# Altium project slave-18-ltc6813-1.PrjPcb (part 2 of 3)

## Sheet feedback.SchDoc: foxBMS BMS-Slave 12-Cell
size A3; DocumentNumber: 6; SheetNumber: 6; SheetTotal: 15; AUTHOR: Fraunhofer IISB foxBMS Team; SheetDescription: Passive Balancing Feedback
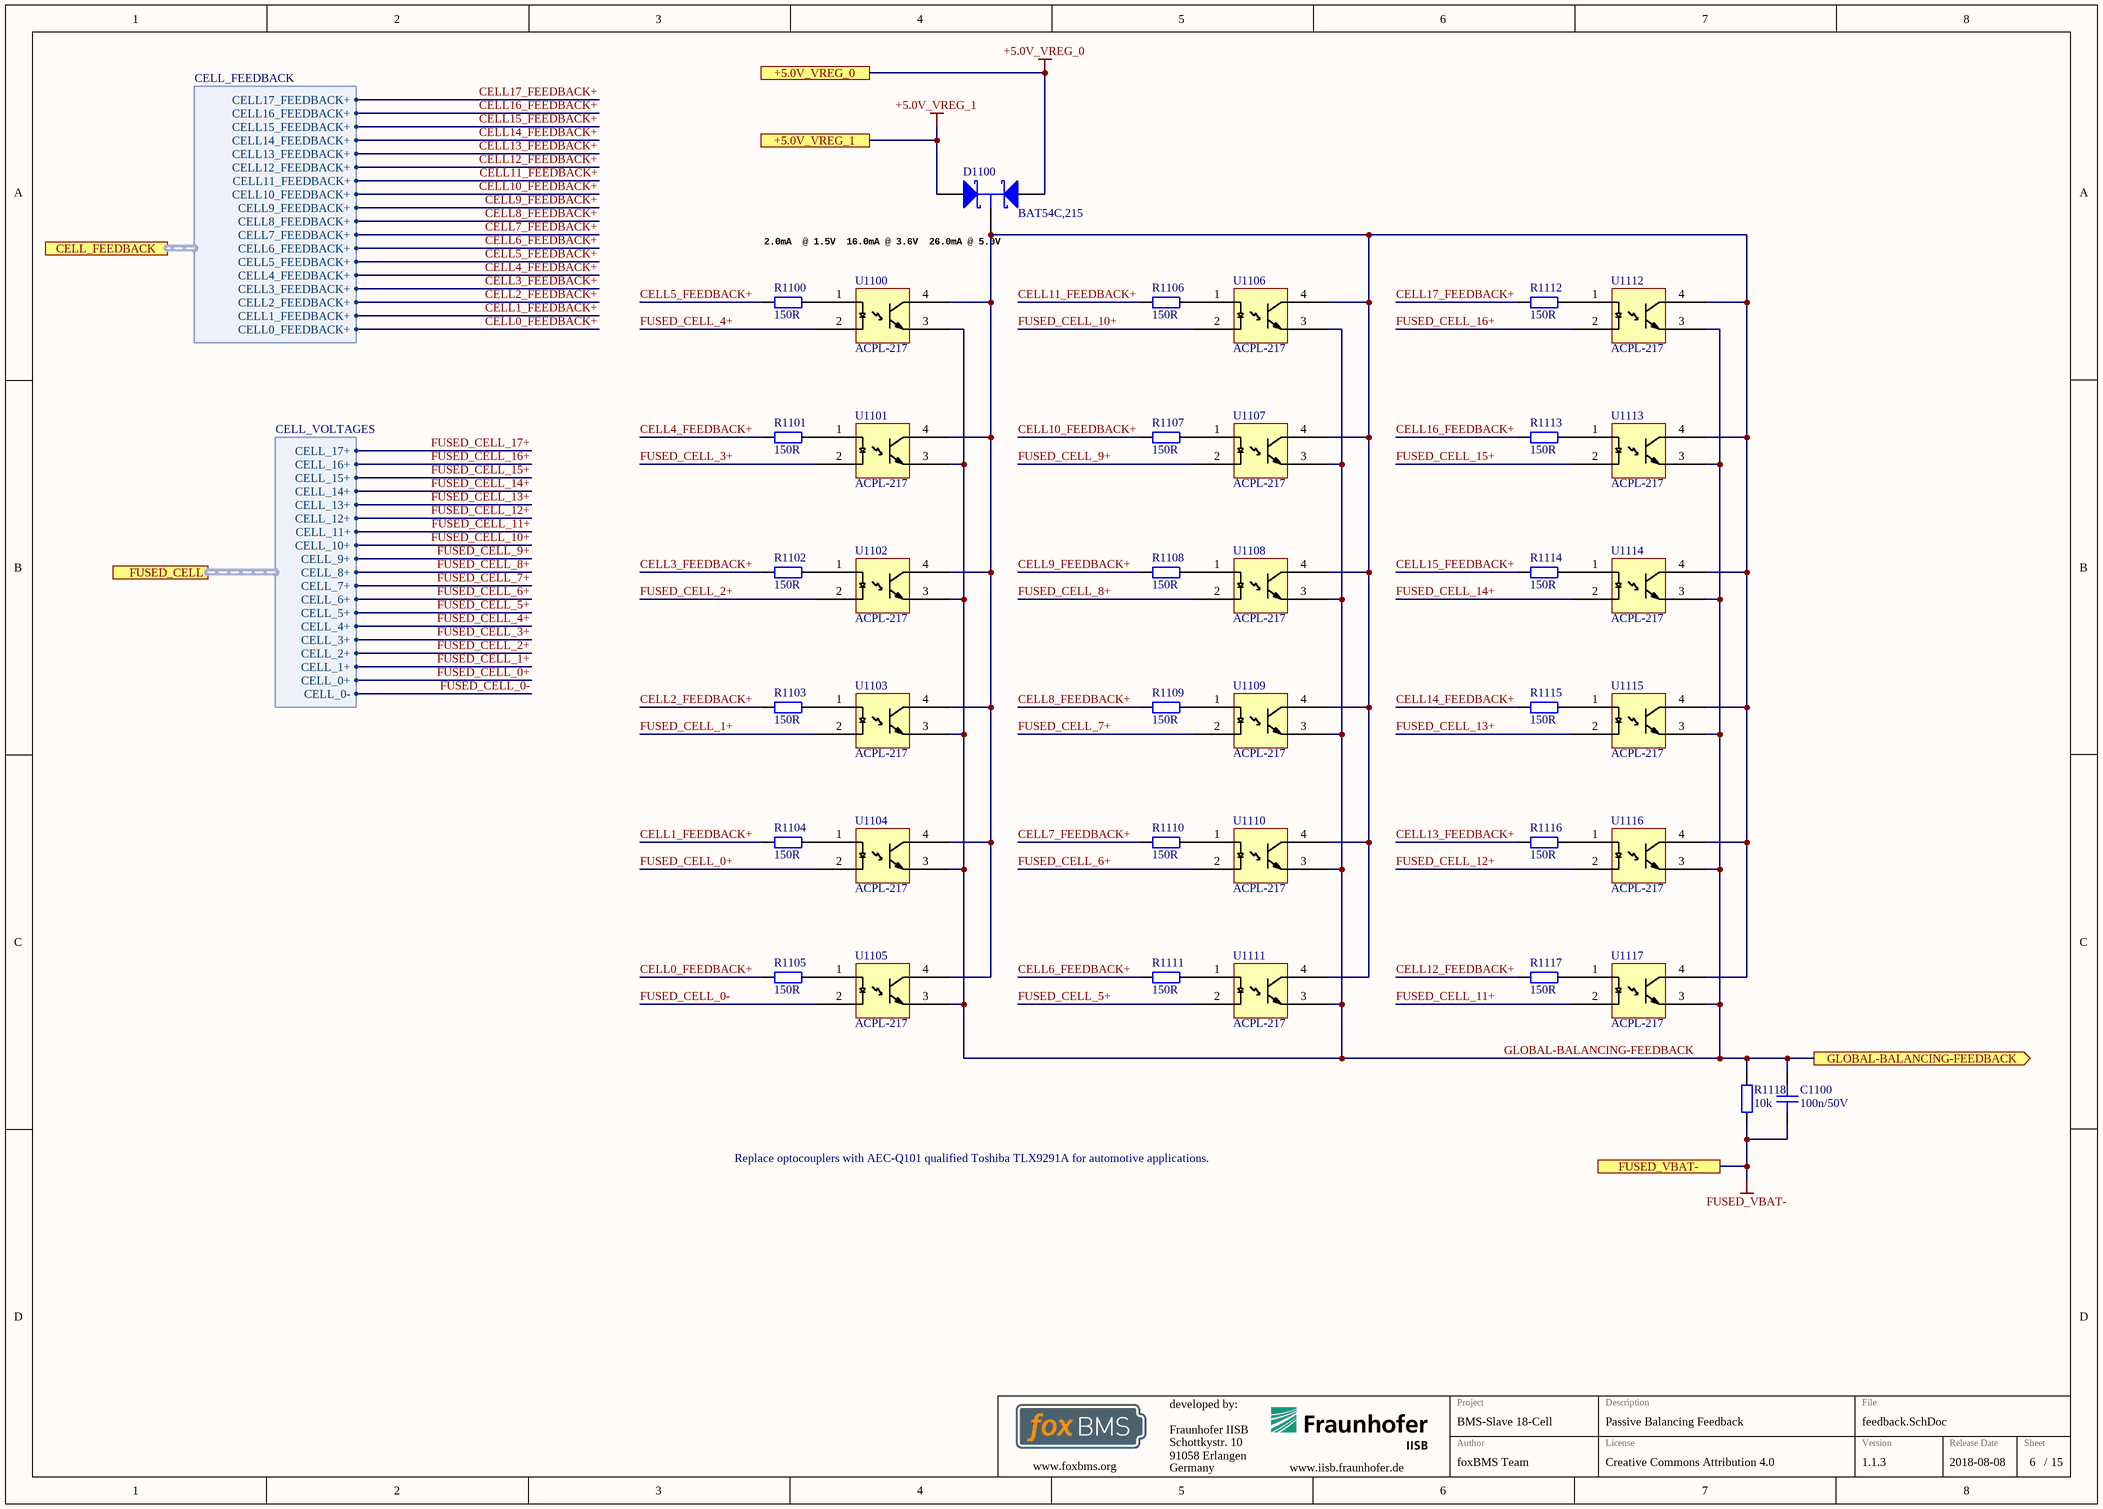
[diagram p5: feedback.SchDoc]

### Parts
C1100  100n/50V  [CAPC1608X08N]
D1100  BAT54C,215  [NXP-SOT23-3_V]
R1100  150R  [RESC1608X05N]
R1101  150R  [RESC1608X05N]
R1102  150R  [RESC1608X05N]
R1103  150R  [RESC1608X05N]
R1104  150R  [RESC1608X05N]
R1105  150R  [RESC1608X05N]
R1106  150R  [RESC1608X05N]
R1107  150R  [RESC1608X05N]
R1108  150R  [RESC1608X05N]
R1109  150R  [RESC1608X05N]
R1110  150R  [RESC1608X05N]
R1111  150R  [RESC1608X05N]
R1112  150R  [RESC1608X05N]
R1113  150R  [RESC1608X05N]
R1114  150R  [RESC1608X05N]
R1115  150R  [RESC1608X05N]
R1116  150R  [RESC1608X05N]
R1117  150R  [RESC1608X05N]
R1118  10k  [RESC1608X05N]
U1100  ACPL-217  [SOIC127P700X220-4N]
U1101  ACPL-217  [SOIC127P700X220-4N]
U1102  ACPL-217  [SOIC127P700X220-4N]
U1103  ACPL-217  [SOIC127P700X220-4N]
U1104  ACPL-217  [SOIC127P700X220-4N]
U1105  ACPL-217  [SOIC127P700X220-4N]
U1106  ACPL-217  [SOIC127P700X220-4N]
U1107  ACPL-217  [SOIC127P700X220-4N]
U1108  ACPL-217  [SOIC127P700X220-4N]
U1109  ACPL-217  [SOIC127P700X220-4N]
U1110  ACPL-217  [SOIC127P700X220-4N]
U1111  ACPL-217  [SOIC127P700X220-4N]
U1112  ACPL-217  [SOIC127P700X220-4N]
U1113  ACPL-217  [SOIC127P700X220-4N]
U1114  ACPL-217  [SOIC127P700X220-4N]
U1115  ACPL-217  [SOIC127P700X220-4N]
U1116  ACPL-217  [SOIC127P700X220-4N]
U1117  ACPL-217  [SOIC127P700X220-4N]

### Ports
+5.0V_VREG_0, +5.0V_VREG_1, CELL_FEEDBACK (harness CELL_FEEDBACK), FUSED_CELL (harness CELL_VOLTAGES), FUSED_VBAT-, GLOBAL-BALANCING-FEEDBACK (out)

### Harnesses
CELL_VOLTAGES: CELL_0-, CELL_0+, CELL_1+, CELL_10+, CELL_11+, CELL_12+, CELL_13+, CELL_14+, CELL_15+, CELL_16+, CELL_17+, CELL_2+, CELL_3+, CELL_4+, CELL_5+, CELL_6+, CELL_7+, CELL_8+, CELL_9+
CELL_FEEDBACK: CELL11_FEEDBACK+, CELL10_FEEDBACK+, CELL9_FEEDBACK+, CELL8_FEEDBACK+, CELL7_FEEDBACK+, CELL6_FEEDBACK+, CELL5_FEEDBACK+, CELL4_FEEDBACK+, CELL3_FEEDBACK+, CELL2_FEEDBACK+, CELL1_FEEDBACK+, CELL0_FEEDBACK+, CELL12_FEEDBACK+, CELL13_FEEDBACK+, CELL14_FEEDBACK+, CELL15_FEEDBACK+, CELL16_FEEDBACK+, CELL17_FEEDBACK+

### Nets
+5.0V_VREG_0: D1100.2(A) ; port +5.0V_VREG_0  [project net +5.0V_VREG]
+5.0V_VREG_1: D1100.1(A) ; port +5.0V_VREG_1  [project net +5.0V_VREG]
FUSED_VBAT-: C1100.1 R1118.2 ; port FUSED_VBAT-
CELL0_FEEDBACK+: R1105.1 ; port CELL_FEEDBACK.CELL0_FEEDBACK+  [project net CELL_FEEDBACK.CELL0_FEEDBACK+]
CELL1_FEEDBACK+: R1104.1 ; port CELL_FEEDBACK.CELL1_FEEDBACK+  [project net CELL_FEEDBACK.CELL1_FEEDBACK+]
CELL2_FEEDBACK+: R1103.1 ; port CELL_FEEDBACK.CELL2_FEEDBACK+  [project net CELL_FEEDBACK.CELL2_FEEDBACK+]
CELL3_FEEDBACK+: R1102.1 ; port CELL_FEEDBACK.CELL3_FEEDBACK+  [project net CELL_FEEDBACK.CELL3_FEEDBACK+]
CELL4_FEEDBACK+: R1101.1 ; port CELL_FEEDBACK.CELL4_FEEDBACK+  [project net CELL_FEEDBACK.CELL4_FEEDBACK+]
CELL5_FEEDBACK+: R1100.1 ; port CELL_FEEDBACK.CELL5_FEEDBACK+  [project net CELL_FEEDBACK.CELL5_FEEDBACK+]
CELL6_FEEDBACK+: R1111.1 ; port CELL_FEEDBACK.CELL6_FEEDBACK+  [project net CELL_FEEDBACK.CELL6_FEEDBACK+]
CELL7_FEEDBACK+: R1110.1 ; port CELL_FEEDBACK.CELL7_FEEDBACK+  [project net CELL_FEEDBACK.CELL7_FEEDBACK+]
CELL8_FEEDBACK+: R1109.1 ; port CELL_FEEDBACK.CELL8_FEEDBACK+  [project net CELL_FEEDBACK.CELL8_FEEDBACK+]
CELL9_FEEDBACK+: R1108.1 ; port CELL_FEEDBACK.CELL9_FEEDBACK+  [project net CELL_FEEDBACK.CELL9_FEEDBACK+]
CELL10_FEEDBACK+: R1107.1 ; port CELL_FEEDBACK.CELL10_FEEDBACK+  [project net CELL_FEEDBACK.CELL10_FEEDBACK+]
CELL11_FEEDBACK+: R1106.1 ; port CELL_FEEDBACK.CELL11_FEEDBACK+  [project net CELL_FEEDBACK.CELL11_FEEDBACK+]
CELL12_FEEDBACK+: R1117.1 ; port CELL_FEEDBACK.CELL12_FEEDBACK+  [project net CELL_FEEDBACK.CELL12_FEEDBACK+]
CELL13_FEEDBACK+: R1116.1 ; port CELL_FEEDBACK.CELL13_FEEDBACK+  [project net CELL_FEEDBACK.CELL13_FEEDBACK+]
CELL14_FEEDBACK+: R1115.1 ; port CELL_FEEDBACK.CELL14_FEEDBACK+  [project net CELL_FEEDBACK.CELL14_FEEDBACK+]
CELL15_FEEDBACK+: R1114.1 ; port CELL_FEEDBACK.CELL15_FEEDBACK+  [project net CELL_FEEDBACK.CELL15_FEEDBACK+]
CELL16_FEEDBACK+: R1113.1 ; port CELL_FEEDBACK.CELL16_FEEDBACK+  [project net CELL_FEEDBACK.CELL16_FEEDBACK+]
CELL17_FEEDBACK+: R1112.1 ; port CELL_FEEDBACK.CELL17_FEEDBACK+  [project net CELL_FEEDBACK.CELL17_FEEDBACK+]
FUSED_CELL_0+: U1104.2 ; port FUSED_CELL.CELL_0+  [project net FUSED_CELL.CELL_0+]
FUSED_CELL_0-: U1105.2 ; port FUSED_CELL.CELL_0-  [project net FUSED_CELL.CELL_0-]
FUSED_CELL_1+: U1103.2 ; port FUSED_CELL.CELL_1+  [project net FUSED_CELL.CELL_1+]
FUSED_CELL_2+: U1102.2 ; port FUSED_CELL.CELL_2+  [project net FUSED_CELL.CELL_2+]
FUSED_CELL_3+: U1101.2 ; port FUSED_CELL.CELL_3+  [project net FUSED_CELL.CELL_3+]
FUSED_CELL_4+: U1100.2 ; port FUSED_CELL.CELL_4+  [project net FUSED_CELL.CELL_4+]
FUSED_CELL_5+: U1111.2 ; port FUSED_CELL.CELL_5+  [project net FUSED_CELL.CELL_5+]
FUSED_CELL_6+: U1110.2 ; port FUSED_CELL.CELL_6+  [project net FUSED_CELL.CELL_6+]
FUSED_CELL_7+: U1109.2 ; port FUSED_CELL.CELL_7+  [project net FUSED_CELL.CELL_7+]
FUSED_CELL_8+: U1108.2 ; port FUSED_CELL.CELL_8+  [project net FUSED_CELL.CELL_8+]
FUSED_CELL_9+: U1107.2 ; port FUSED_CELL.CELL_9+  [project net FUSED_CELL.CELL_9+]
FUSED_CELL_10+: U1106.2 ; port FUSED_CELL.CELL_10+  [project net FUSED_CELL.CELL_10+]
FUSED_CELL_11+: U1117.2 ; port FUSED_CELL.CELL_11+  [project net FUSED_CELL.CELL_11+]
FUSED_CELL_12+: U1116.2 ; port FUSED_CELL.CELL_12+  [project net FUSED_CELL.CELL_12+]
FUSED_CELL_13+: U1115.2 ; port FUSED_CELL.CELL_13+  [project net FUSED_CELL.CELL_13+]
FUSED_CELL_14+: U1114.2 ; port FUSED_CELL.CELL_14+  [project net FUSED_CELL.CELL_14+]
FUSED_CELL_15+: U1113.2 ; port FUSED_CELL.CELL_15+  [project net FUSED_CELL.CELL_15+]
FUSED_CELL_16+: U1112.2 ; port FUSED_CELL.CELL_16+  [project net FUSED_CELL.CELL_16+]
GLOBAL-BALANCING-FEEDBACK: C1100.2 R1118.1 U1100.3 U1101.3 U1102.3 U1103.3 U1104.3 U1105.3 U1106.3 U1107.3 U1108.3 U1109.3 U1110.3 U1111.3 U1112.3 U1113.3 U1114.3 U1115.3 U1116.3 U1117.3 ; port GLOBAL-BALANCING-FEEDBACK  [project net GLOBAL-BAL-FB]
NetD1100_3: D1100.3(K) U1100.4 U1101.4 U1102.4 U1103.4 U1104.4 U1105.4 U1106.4 U1107.4 U1108.4 U1109.4 U1110.4 U1111.4 U1112.4 U1113.4 U1114.4 U1115.4 U1116.4 U1117.4
NetR1100_2: R1100.2 U1100.1
NetR1101_2: R1101.2 U1101.1
NetR1102_2: R1102.2 U1102.1
NetR1103_2: R1103.2 U1103.1
NetR1104_2: R1104.2 U1104.1
NetR1105_2: R1105.2 U1105.1
NetR1106_2: R1106.2 U1106.1
NetR1107_2: R1107.2 U1107.1
NetR1108_2: R1108.2 U1108.1
NetR1109_2: R1109.2 U1109.1
NetR1110_2: R1110.2 U1110.1
NetR1111_2: R1111.2 U1111.1
NetR1112_2: R1112.2 U1112.1
NetR1113_2: R1113.2 U1113.1
NetR1114_2: R1114.2 U1114.1
NetR1115_2: R1115.2 U1115.1
NetR1116_2: R1116.2 U1116.1
NetR1117_2: R1117.2 U1117.1

### Notes on the sheet
- (near D1100) 2.0mA  @ 1.5V
  16.0mA @ 3.6V
  26.0mA @ 5.0V
- Replace optocouplers with AEC-Q101 qualified Toshiba TLX9291A for automotive applications.
- Fraunhofer IISB
- Schottkystr. 10
- developed by:
- 91058 Erlangen
- Germany
- Author
- Project
- License
- Description
- File
- Version
- Release Date
- Sheet
- www.foxbms.org
- www.iisb.fraunhofer.de
- foxBMS Team
- /

### Library data of the parts
C1100 = gen_C_ceramic_100n_50V_X7R_0603: as C903 on sheet ext_supply; Part Number: gen_C_ceramic_100n_50V_X7R_0603; Supplier 1: Farnell; Supplier Part Number 1: 2525267; Supplier 2: Digikey; Supplier Part Number 2: 490-6049-1-ND; Supplier 3: Farnell; Supplier Part Number 3: 2070398
D1100 = CMP-2000-04915-1: Schottky Barrier Diode, 30 V, 3-Pin SOT23, RoHS, Tape and Reel; Manufacturer: NXP Semiconductors; Forward Surge Current Ifsm Max: 600mA; Pin Configuration: 1A1,2A2,3comK; Package Version: Feb-16; Forward Voltage VF Max: 800mV; SMD Marking: L43/*W1; Diode Case Style: SOT-23; Reverse Recovery Time trr Typ: 5ns; Forward Current If(AV): 200mA; Reel Quantity: 3000; SVHC: NoSVHC(19-Dec-2012); No. of Pins: 3; Junction Temperature Tj Max: 125degC; Common Connection: Cathode; Repetitive Reverse Voltage Vrrm Max: 30V; Operating Temperature Max: 150degC; Operating Temperature Range: -65degCto+150degC; Termination Type: SMD; Package Description: 3-Pin Small Outline Transistor, Body 1.3 x 2.9 mm, Pitch 0.95 mm; Package / Case: SOT-23; Diode Type: Schottky; Manufacturer URL: http://www.nxp.com/; Tape Width: 8mm; Package Reference: SOT23-3; Datasheet URL: https://datasheet.ciiva.com/33723/1668625-33723936.pdf; Datasheet Version: Rev. 5 , 10/2012; Operating Temperature Min: -65degC; Current Ifsm: 600mA; Reverse Recovery Time trr Max: 5ns; Package URL: http://www.nxp.com/documents/outline_drawing/SOT23.pdf; Forward Voltage: 800mV
R1100-R1117 = gen_R_150R_0603: SMD Resistor 150R 0603; Tolerance: 1%; Power: 0.1W; Case EIA: 0603; Case Metric: 1608; Maximum Working Voltage: 75V; PnP Package: R_0603; Automotive Qualified: True; Part Number: gen_R_150R_0603; Operating Temperature: -55°C - +155°C; Resistance: 150R; Series: E24, E96; PnP Value: 150R; Supplier 1: Farnell; Supplier Part Number 1: 2303076
R1118 = gen_R_10k_0603: as R905 on sheet ext_supply; Part Number: gen_R_10k_0603; Operating Temperature: -55°C - +155°C; Resistance: 10k; Series: E24, E96; PnP Value: 10k; Supplier 1: Farnell; Supplier Part Number 1: 2073349
U1100-U1117 = ACPL-217-56BE: Optocoupler, Transistor Output, 1 Channel; Manufacturer: Broadcom Limited; Automotive Qualified: False; Part Number: ACPL-217-56BE; Part Name: ACPL-217; Operating Temperature: -55°C - +110°C; ComponentLink1Description: Datenblatt; ComponentLink1URL: http://www.farnell.com/datasheets/45634.pdf; Supplier 1: Farnell; Supplier Part Number 1: 1602623

## Sheet passive_balancing.SchDoc: foxBMS BMS-Slave 12-Cell
size A3; DocumentNumber: 5; SheetNumber: 5; SheetTotal: 15; AUTHOR: Fraunhofer IISB foxBMS Team; SheetDescription: Passive Cell Balancing
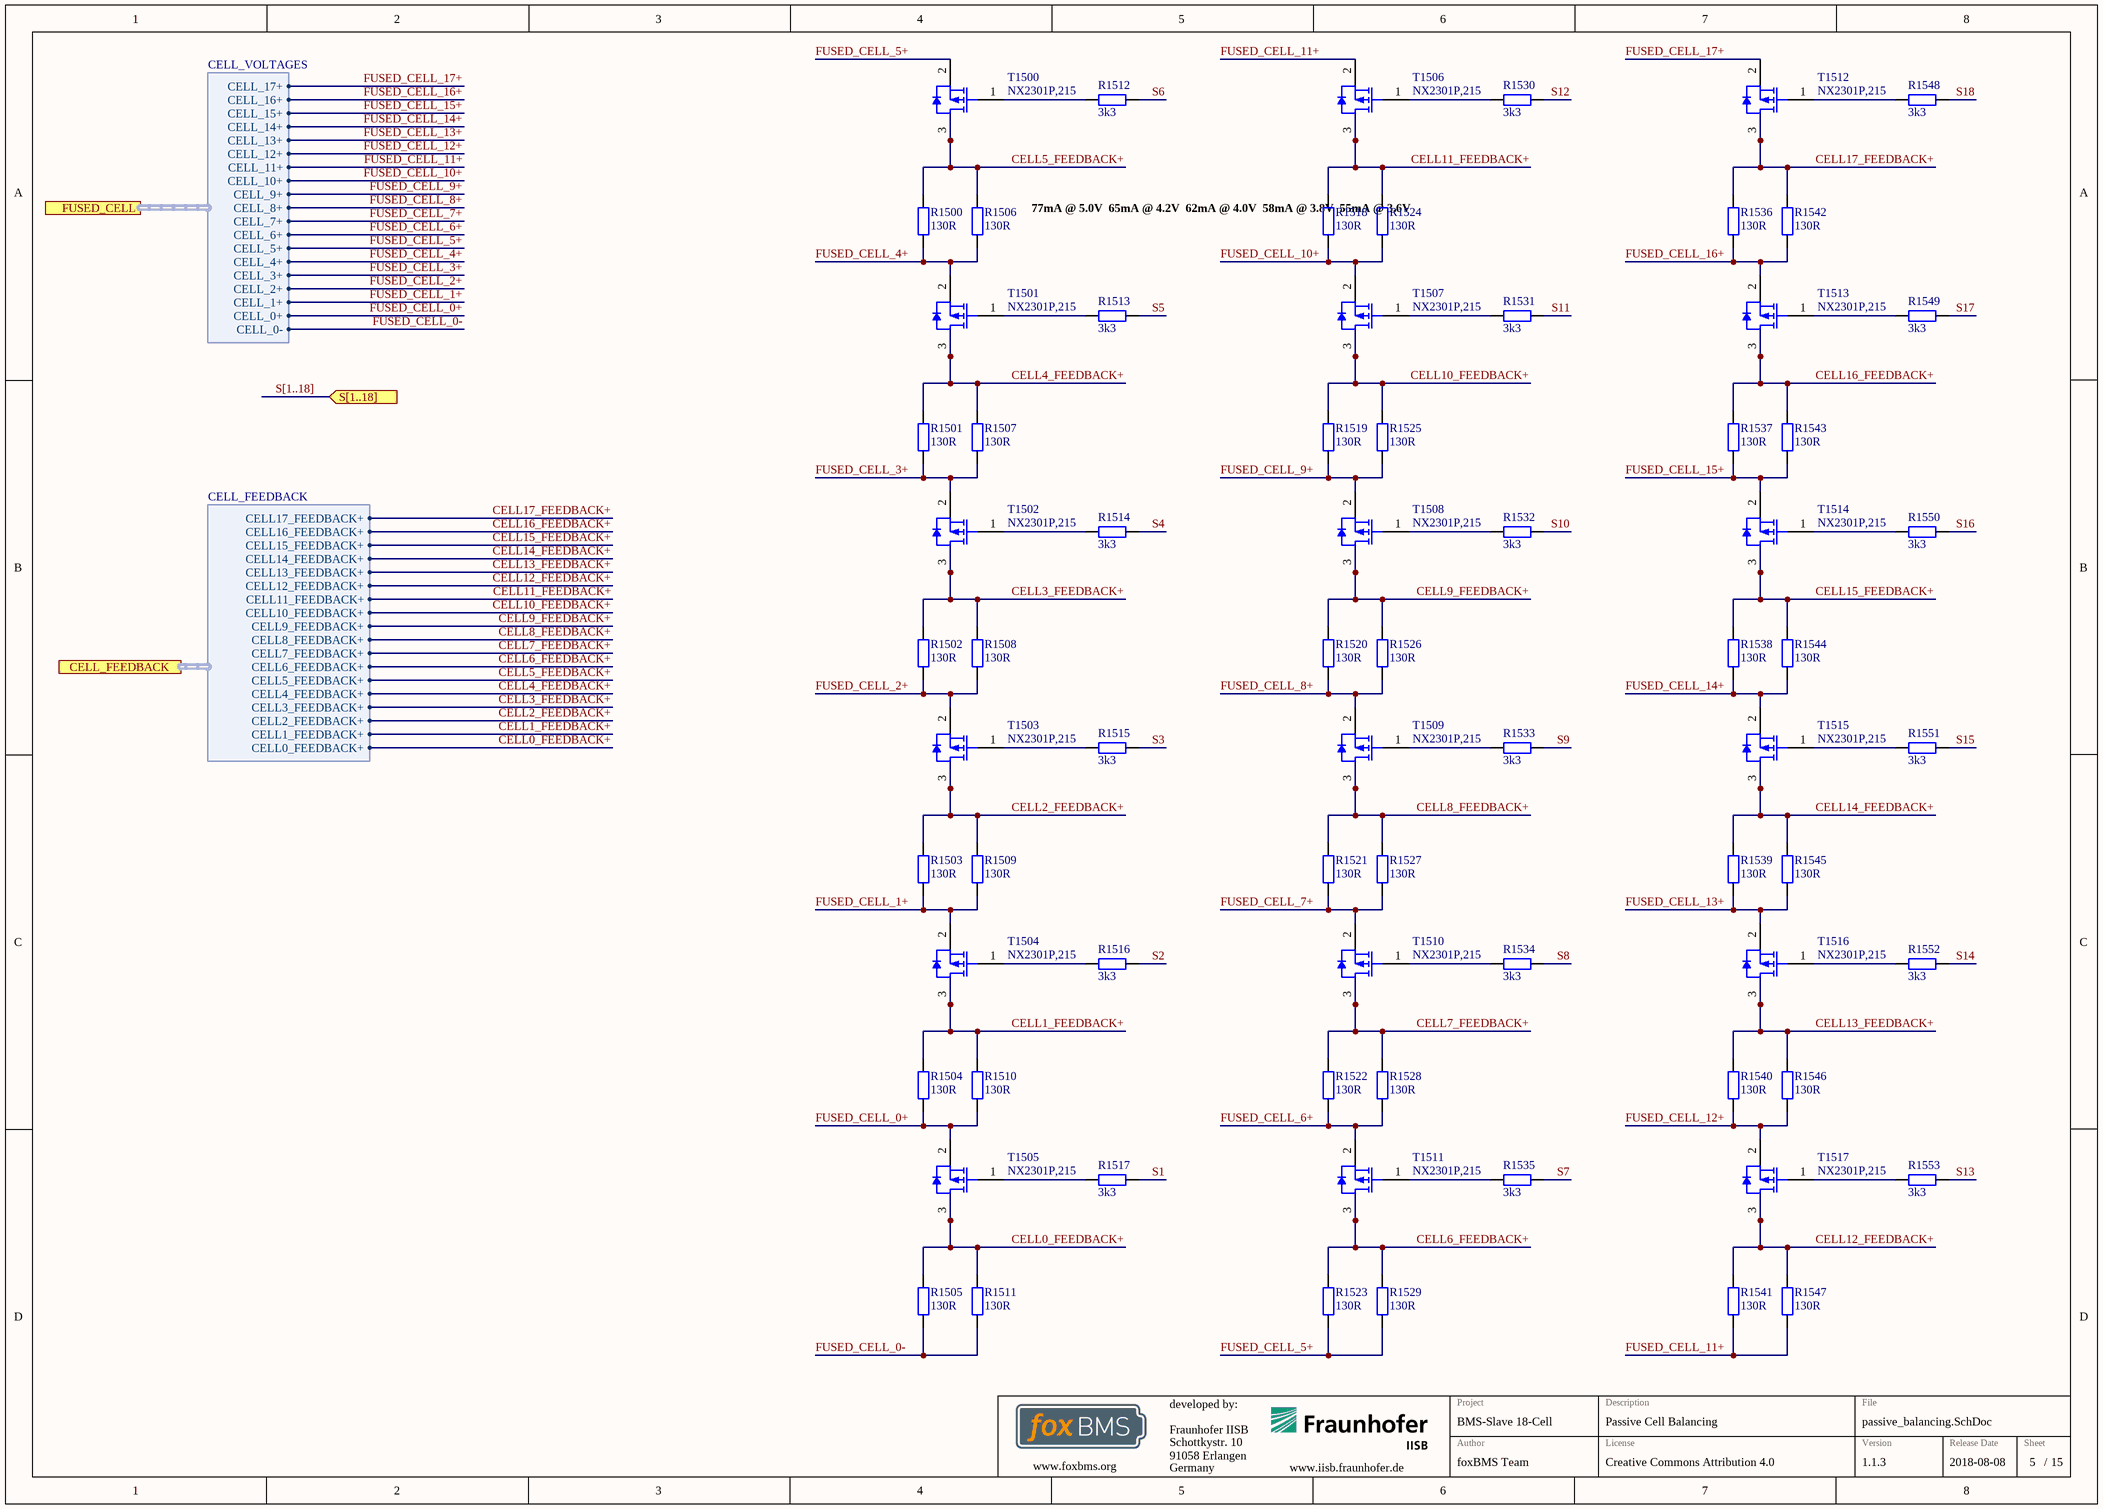
[diagram p6: passive_balancing.SchDoc]

### Parts
R1500  130R  [RESC5025X07N]
R1501  130R  [RESC5025X07N]
R1502  130R  [RESC5025X07N]
R1503  130R  [RESC5025X07N]
R1504  130R  [RESC5025X07N]
R1505  130R  [RESC5025X07N]
R1506  130R  [RESC5025X07N]
R1507  130R  [RESC5025X07N]
R1508  130R  [RESC5025X07N]
R1509  130R  [RESC5025X07N]
R1510  130R  [RESC5025X07N]
R1511  130R  [RESC5025X07N]
R1512  3k3  [RESC1608X05N]
R1513  3k3  [RESC1608X05N]
R1514  3k3  [RESC1608X05N]
R1515  3k3  [RESC1608X05N]
R1516  3k3  [RESC1608X05N]
R1517  3k3  [RESC1608X05N]
R1518  130R  [RESC5025X07N]
R1519  130R  [RESC5025X07N]
R1520  130R  [RESC5025X07N]
R1521  130R  [RESC5025X07N]
R1522  130R  [RESC5025X07N]
R1523  130R  [RESC5025X07N]
R1524  130R  [RESC5025X07N]
R1525  130R  [RESC5025X07N]
R1526  130R  [RESC5025X07N]
R1527  130R  [RESC5025X07N]
R1528  130R  [RESC5025X07N]
R1529  130R  [RESC5025X07N]
R1530  3k3  [RESC1608X05N]
R1531  3k3  [RESC1608X05N]
R1532  3k3  [RESC1608X05N]
R1533  3k3  [RESC1608X05N]
R1534  3k3  [RESC1608X05N]
R1535  3k3  [RESC1608X05N]
R1536  130R  [RESC5025X07N]
R1537  130R  [RESC5025X07N]
R1538  130R  [RESC5025X07N]
R1539  130R  [RESC5025X07N]
R1540  130R  [RESC5025X07N]
R1541  130R  [RESC5025X07N]
R1542  130R  [RESC5025X07N]
R1543  130R  [RESC5025X07N]
R1544  130R  [RESC5025X07N]
R1545  130R  [RESC5025X07N]
R1546  130R  [RESC5025X07N]
R1547  130R  [RESC5025X07N]
R1548  3k3  [RESC1608X05N]
R1549  3k3  [RESC1608X05N]
R1550  3k3  [RESC1608X05N]
R1551  3k3  [RESC1608X05N]
R1552  3k3  [RESC1608X05N]
R1553  3k3  [RESC1608X05N]
T1500  NX2301P,215  [NXP-SOT23_N]
T1501  NX2301P,215  [NXP-SOT23_N]
T1502  NX2301P,215  [NXP-SOT23_N]
T1503  NX2301P,215  [NXP-SOT23_N]
T1504  NX2301P,215  [NXP-SOT23_N]
T1505  NX2301P,215  [NXP-SOT23_N]
T1506  NX2301P,215  [NXP-SOT23_N]
T1507  NX2301P,215  [NXP-SOT23_N]
T1508  NX2301P,215  [NXP-SOT23_N]
T1509  NX2301P,215  [NXP-SOT23_N]
T1510  NX2301P,215  [NXP-SOT23_N]
T1511  NX2301P,215  [NXP-SOT23_N]
T1512  NX2301P,215  [NXP-SOT23_N]
T1513  NX2301P,215  [NXP-SOT23_N]
T1514  NX2301P,215  [NXP-SOT23_N]
T1515  NX2301P,215  [NXP-SOT23_N]
T1516  NX2301P,215  [NXP-SOT23_N]
T1517  NX2301P,215  [NXP-SOT23_N]

### Ports
CELL_FEEDBACK (harness CELL_FEEDBACK), FUSED_CELL (harness CELL_VOLTAGES), S[1..18] (in)

### Harnesses
CELL_FEEDBACK: CELL11_FEEDBACK+, CELL10_FEEDBACK+, CELL9_FEEDBACK+, CELL8_FEEDBACK+, CELL7_FEEDBACK+, CELL6_FEEDBACK+, CELL5_FEEDBACK+, CELL4_FEEDBACK+, CELL3_FEEDBACK+, CELL2_FEEDBACK+, CELL1_FEEDBACK+, CELL0_FEEDBACK+, CELL12_FEEDBACK+, CELL13_FEEDBACK+, CELL14_FEEDBACK+, CELL15_FEEDBACK+, CELL16_FEEDBACK+, CELL17_FEEDBACK+
CELL_VOLTAGES: CELL_0-, CELL_0+, CELL_1+, CELL_10+, CELL_11+, CELL_12+, CELL_13+, CELL_14+, CELL_15+, CELL_16+, CELL_17+, CELL_2+, CELL_3+, CELL_4+, CELL_5+, CELL_6+, CELL_7+, CELL_8+, CELL_9+

### Nets
CELL0_FEEDBACK+: R1505.2 R1511.2 T1505.3(D) ; port CELL_FEEDBACK.CELL0_FEEDBACK+  [project net CELL_FEEDBACK.CELL0_FEEDBACK+]
CELL1_FEEDBACK+: R1504.2 R1510.2 T1504.3(D) ; port CELL_FEEDBACK.CELL1_FEEDBACK+  [project net CELL_FEEDBACK.CELL1_FEEDBACK+]
CELL2_FEEDBACK+: R1503.2 R1509.2 T1503.3(D) ; port CELL_FEEDBACK.CELL2_FEEDBACK+  [project net CELL_FEEDBACK.CELL2_FEEDBACK+]
CELL3_FEEDBACK+: R1502.2 R1508.2 T1502.3(D) ; port CELL_FEEDBACK.CELL3_FEEDBACK+  [project net CELL_FEEDBACK.CELL3_FEEDBACK+]
CELL4_FEEDBACK+: R1501.2 R1507.2 T1501.3(D) ; port CELL_FEEDBACK.CELL4_FEEDBACK+  [project net CELL_FEEDBACK.CELL4_FEEDBACK+]
CELL5_FEEDBACK+: R1500.2 R1506.2 T1500.3(D) ; port CELL_FEEDBACK.CELL5_FEEDBACK+  [project net CELL_FEEDBACK.CELL5_FEEDBACK+]
CELL6_FEEDBACK+: R1523.2 R1529.2 T1511.3(D) ; port CELL_FEEDBACK.CELL6_FEEDBACK+  [project net CELL_FEEDBACK.CELL6_FEEDBACK+]
CELL7_FEEDBACK+: R1522.2 R1528.2 T1510.3(D) ; port CELL_FEEDBACK.CELL7_FEEDBACK+  [project net CELL_FEEDBACK.CELL7_FEEDBACK+]
CELL8_FEEDBACK+: R1521.2 R1527.2 T1509.3(D) ; port CELL_FEEDBACK.CELL8_FEEDBACK+  [project net CELL_FEEDBACK.CELL8_FEEDBACK+]
CELL9_FEEDBACK+: R1520.2 R1526.2 T1508.3(D) ; port CELL_FEEDBACK.CELL9_FEEDBACK+  [project net CELL_FEEDBACK.CELL9_FEEDBACK+]
CELL10_FEEDBACK+: R1519.2 R1525.2 T1507.3(D) ; port CELL_FEEDBACK.CELL10_FEEDBACK+  [project net CELL_FEEDBACK.CELL10_FEEDBACK+]
CELL11_FEEDBACK+: R1518.2 R1524.2 T1506.3(D) ; port CELL_FEEDBACK.CELL11_FEEDBACK+  [project net CELL_FEEDBACK.CELL11_FEEDBACK+]
CELL12_FEEDBACK+: R1541.2 R1547.2 T1517.3(D) ; port CELL_FEEDBACK.CELL12_FEEDBACK+  [project net CELL_FEEDBACK.CELL12_FEEDBACK+]
CELL13_FEEDBACK+: R1540.2 R1546.2 T1516.3(D) ; port CELL_FEEDBACK.CELL13_FEEDBACK+  [project net CELL_FEEDBACK.CELL13_FEEDBACK+]
CELL14_FEEDBACK+: R1539.2 R1545.2 T1515.3(D) ; port CELL_FEEDBACK.CELL14_FEEDBACK+  [project net CELL_FEEDBACK.CELL14_FEEDBACK+]
CELL15_FEEDBACK+: R1538.2 R1544.2 T1514.3(D) ; port CELL_FEEDBACK.CELL15_FEEDBACK+  [project net CELL_FEEDBACK.CELL15_FEEDBACK+]
CELL16_FEEDBACK+: R1537.2 R1543.2 T1513.3(D) ; port CELL_FEEDBACK.CELL16_FEEDBACK+  [project net CELL_FEEDBACK.CELL16_FEEDBACK+]
CELL17_FEEDBACK+: R1536.2 R1542.2 T1512.3(D) ; port CELL_FEEDBACK.CELL17_FEEDBACK+  [project net CELL_FEEDBACK.CELL17_FEEDBACK+]
FUSED_CELL_0+: R1504.1 R1510.1 T1505.2(S) ; port FUSED_CELL.CELL_0+  [project net FUSED_CELL.CELL_0+]
FUSED_CELL_0-: R1505.1 R1511.1 ; port FUSED_CELL.CELL_0-  [project net FUSED_CELL.CELL_0-]
FUSED_CELL_1+: R1503.1 R1509.1 T1504.2(S) ; port FUSED_CELL.CELL_1+  [project net FUSED_CELL.CELL_1+]
FUSED_CELL_2+: R1502.1 R1508.1 T1503.2(S) ; port FUSED_CELL.CELL_2+  [project net FUSED_CELL.CELL_2+]
FUSED_CELL_3+: R1501.1 R1507.1 T1502.2(S) ; port FUSED_CELL.CELL_3+  [project net FUSED_CELL.CELL_3+]
FUSED_CELL_4+: R1500.1 R1506.1 T1501.2(S) ; port FUSED_CELL.CELL_4+  [project net FUSED_CELL.CELL_4+]
FUSED_CELL_5+: R1523.1 R1529.1 T1500.2(S) ; port FUSED_CELL.CELL_5+  [project net FUSED_CELL.CELL_5+]
FUSED_CELL_6+: R1522.1 R1528.1 T1511.2(S) ; port FUSED_CELL.CELL_6+  [project net FUSED_CELL.CELL_6+]
FUSED_CELL_7+: R1521.1 R1527.1 T1510.2(S) ; port FUSED_CELL.CELL_7+  [project net FUSED_CELL.CELL_7+]
FUSED_CELL_8+: R1520.1 R1526.1 T1509.2(S) ; port FUSED_CELL.CELL_8+  [project net FUSED_CELL.CELL_8+]
FUSED_CELL_9+: R1519.1 R1525.1 T1508.2(S) ; port FUSED_CELL.CELL_9+  [project net FUSED_CELL.CELL_9+]
FUSED_CELL_10+: R1518.1 R1524.1 T1507.2(S) ; port FUSED_CELL.CELL_10+  [project net FUSED_CELL.CELL_10+]
FUSED_CELL_11+: R1541.1 R1547.1 T1506.2(S) ; port FUSED_CELL.CELL_11+  [project net FUSED_CELL.CELL_11+]
FUSED_CELL_12+: R1540.1 R1546.1 T1517.2(S) ; port FUSED_CELL.CELL_12+  [project net FUSED_CELL.CELL_12+]
FUSED_CELL_13+: R1539.1 R1545.1 T1516.2(S) ; port FUSED_CELL.CELL_13+  [project net FUSED_CELL.CELL_13+]
FUSED_CELL_14+: R1538.1 R1544.1 T1515.2(S) ; port FUSED_CELL.CELL_14+  [project net FUSED_CELL.CELL_14+]
FUSED_CELL_15+: R1537.1 R1543.1 T1514.2(S) ; port FUSED_CELL.CELL_15+  [project net FUSED_CELL.CELL_15+]
FUSED_CELL_16+: R1536.1 R1542.1 T1513.2(S) ; port FUSED_CELL.CELL_16+  [project net FUSED_CELL.CELL_16+]
FUSED_CELL_17+: T1512.2(S) ; port FUSED_CELL.CELL_17+  [project net FUSED_CELL.CELL_17+]
S1: R1517.2  [project net PRIMARY-S1]
S2: R1516.2  [project net PRIMARY-S2]
S3: R1515.2  [project net PRIMARY-S3]
S4: R1514.2  [project net PRIMARY-S4]
S5: R1513.2  [project net PRIMARY-S5]
S6: R1512.2  [project net PRIMARY-S6]
S7: R1535.2  [project net PRIMARY-S7]
S8: R1534.2  [project net PRIMARY-S8]
S9: R1533.2  [project net PRIMARY-S9]
S10: R1532.2  [project net PRIMARY-S10]
S11: R1531.2  [project net PRIMARY-S11]
S12: R1530.2  [project net PRIMARY-S12]
S13: R1553.2  [project net PRIMARY-S13]
S14: R1552.2  [project net PRIMARY-S14]
S15: R1551.2  [project net PRIMARY-S15]
S16: R1550.2  [project net PRIMARY-S16]
S17: R1549.2  [project net PRIMARY-S17]
S18: R1548.2  [project net PRIMARY-S18]
NetR1512_1: R1512.1 T1500.1(G)
NetR1513_1: R1513.1 T1501.1(G)
NetR1514_1: R1514.1 T1502.1(G)
NetR1515_1: R1515.1 T1503.1(G)
NetR1516_1: R1516.1 T1504.1(G)
NetR1517_1: R1517.1 T1505.1(G)
NetR1530_1: R1530.1 T1506.1(G)
NetR1531_1: R1531.1 T1507.1(G)
NetR1532_1: R1532.1 T1508.1(G)
NetR1533_1: R1533.1 T1509.1(G)
NetR1534_1: R1534.1 T1510.1(G)
NetR1535_1: R1535.1 T1511.1(G)
NetR1548_1: R1548.1 T1512.1(G)
NetR1549_1: R1549.1 T1513.1(G)
NetR1550_1: R1550.1 T1514.1(G)
NetR1551_1: R1551.1 T1515.1(G)
NetR1552_1: R1552.1 T1516.1(G)
NetR1553_1: R1553.1 T1517.1(G)

### Buses and harness runs
bus S[1..18] = port S[1..18]

### Notes on the sheet
- 77mA @ 5.0V
  65mA @ 4.2V
  62mA @ 4.0V
  58mA @ 3.8V
  55mA @ 3.6V
- Fraunhofer IISB
- Schottkystr. 10
- developed by:
- 91058 Erlangen
- Germany
- Author
- Project
- License
- Description
- File
- Version
- Release Date
- Sheet
- www.foxbms.org
- www.iisb.fraunhofer.de
- foxBMS Team
- /

### Library data of the parts
R1500-R1511 R1518-R1529 R1536-R1547 = gen_R_130R_2010: SMD Resistor 130R 2010; Tolerance: 5%; Power: 0.75W; Case EIA: 2010; Case Metric: 5025; Maximum Working Voltage: 400V; PnP Package: R_2010; Automotive Qualified: True; Part Number: gen_R_130R_2010; Operating Temperature: -55°C - +155°C; Resistance: 130R; Series: E24, E96; PnP Value: 130R; Supplier 1: Farnell; Supplier Part Number 1: 1892735
R1512-R1517 R1530-R1535 R1548-R1553 = gen_R_3k3_0603: SMD Resistor 3k3 0603; Tolerance: 1%; Power: 0.1W; Case EIA: 0603; Case Metric: 1608; Maximum Working Voltage: 75V; PnP Package: R_0603; Automotive Qualified: True; Part Number: gen_R_3k3_0603; Operating Temperature: -55°C - +155°C; Resistance: 3k3; Series: E24; PnP Value: 3k3; Supplier 1: Farnell; Supplier Part Number 1: 2303173
T1500-T1517 = CMP-1259-00090-1: P-Channel Trench MOSFET, -20 V, -2 A, -55 to 150 degC, 3-Pin SOT23, Tape and Reel; Manufacturer: NXP Semiconductors; VGSth [typ] (V): -0.75; Channel Type: P; Packing: Tape & Reel; Automotive Qualified: Y; IDM [max] (A): -6; PackageReference: SOT23; PartNumber: NX2301P,215; PackageVersion: 06-03-16, 03/2006; ComponentLink1URL: http://www.nxp.com/; ID [max] (A): -2; Mounting Technology: Surface Mount; ComponentLink1Description: Manufacturer URL; VDS [max] (V): -20; Code_JEDEC: TO-236AB; DatasheetVersion: Rev. 1; ComponentLink3URL: http://www.nxp.com/documents/outline_drawing/sot023_po.pdf; ComponentLink2Description: Datasheet; PackageDescription: 3-Pin Small Outline Transistor Package, Body 2.9 x 1.3 mm, Pitch 0.95 mm; ComponentLink3Description: Package Specification; ComponentLink2URL: http://www.nxp.com/documents/data_sheet/NX2301P.pdf

## Sheet LTC.SchDoc: foxBMS BMS-Slave 12-Cell
size A3; DocumentNumber: 2; SheetNumber: 2; SheetTotal: 15; AUTHOR: Fraunhofer IISB foxBMS Team; SheetDescription: Primary LTC6813
Used 2 times, as channels U_primary_LTC, U_secondary_LTC. Parts and nets are listed once, with the designators drawn on the sheet.
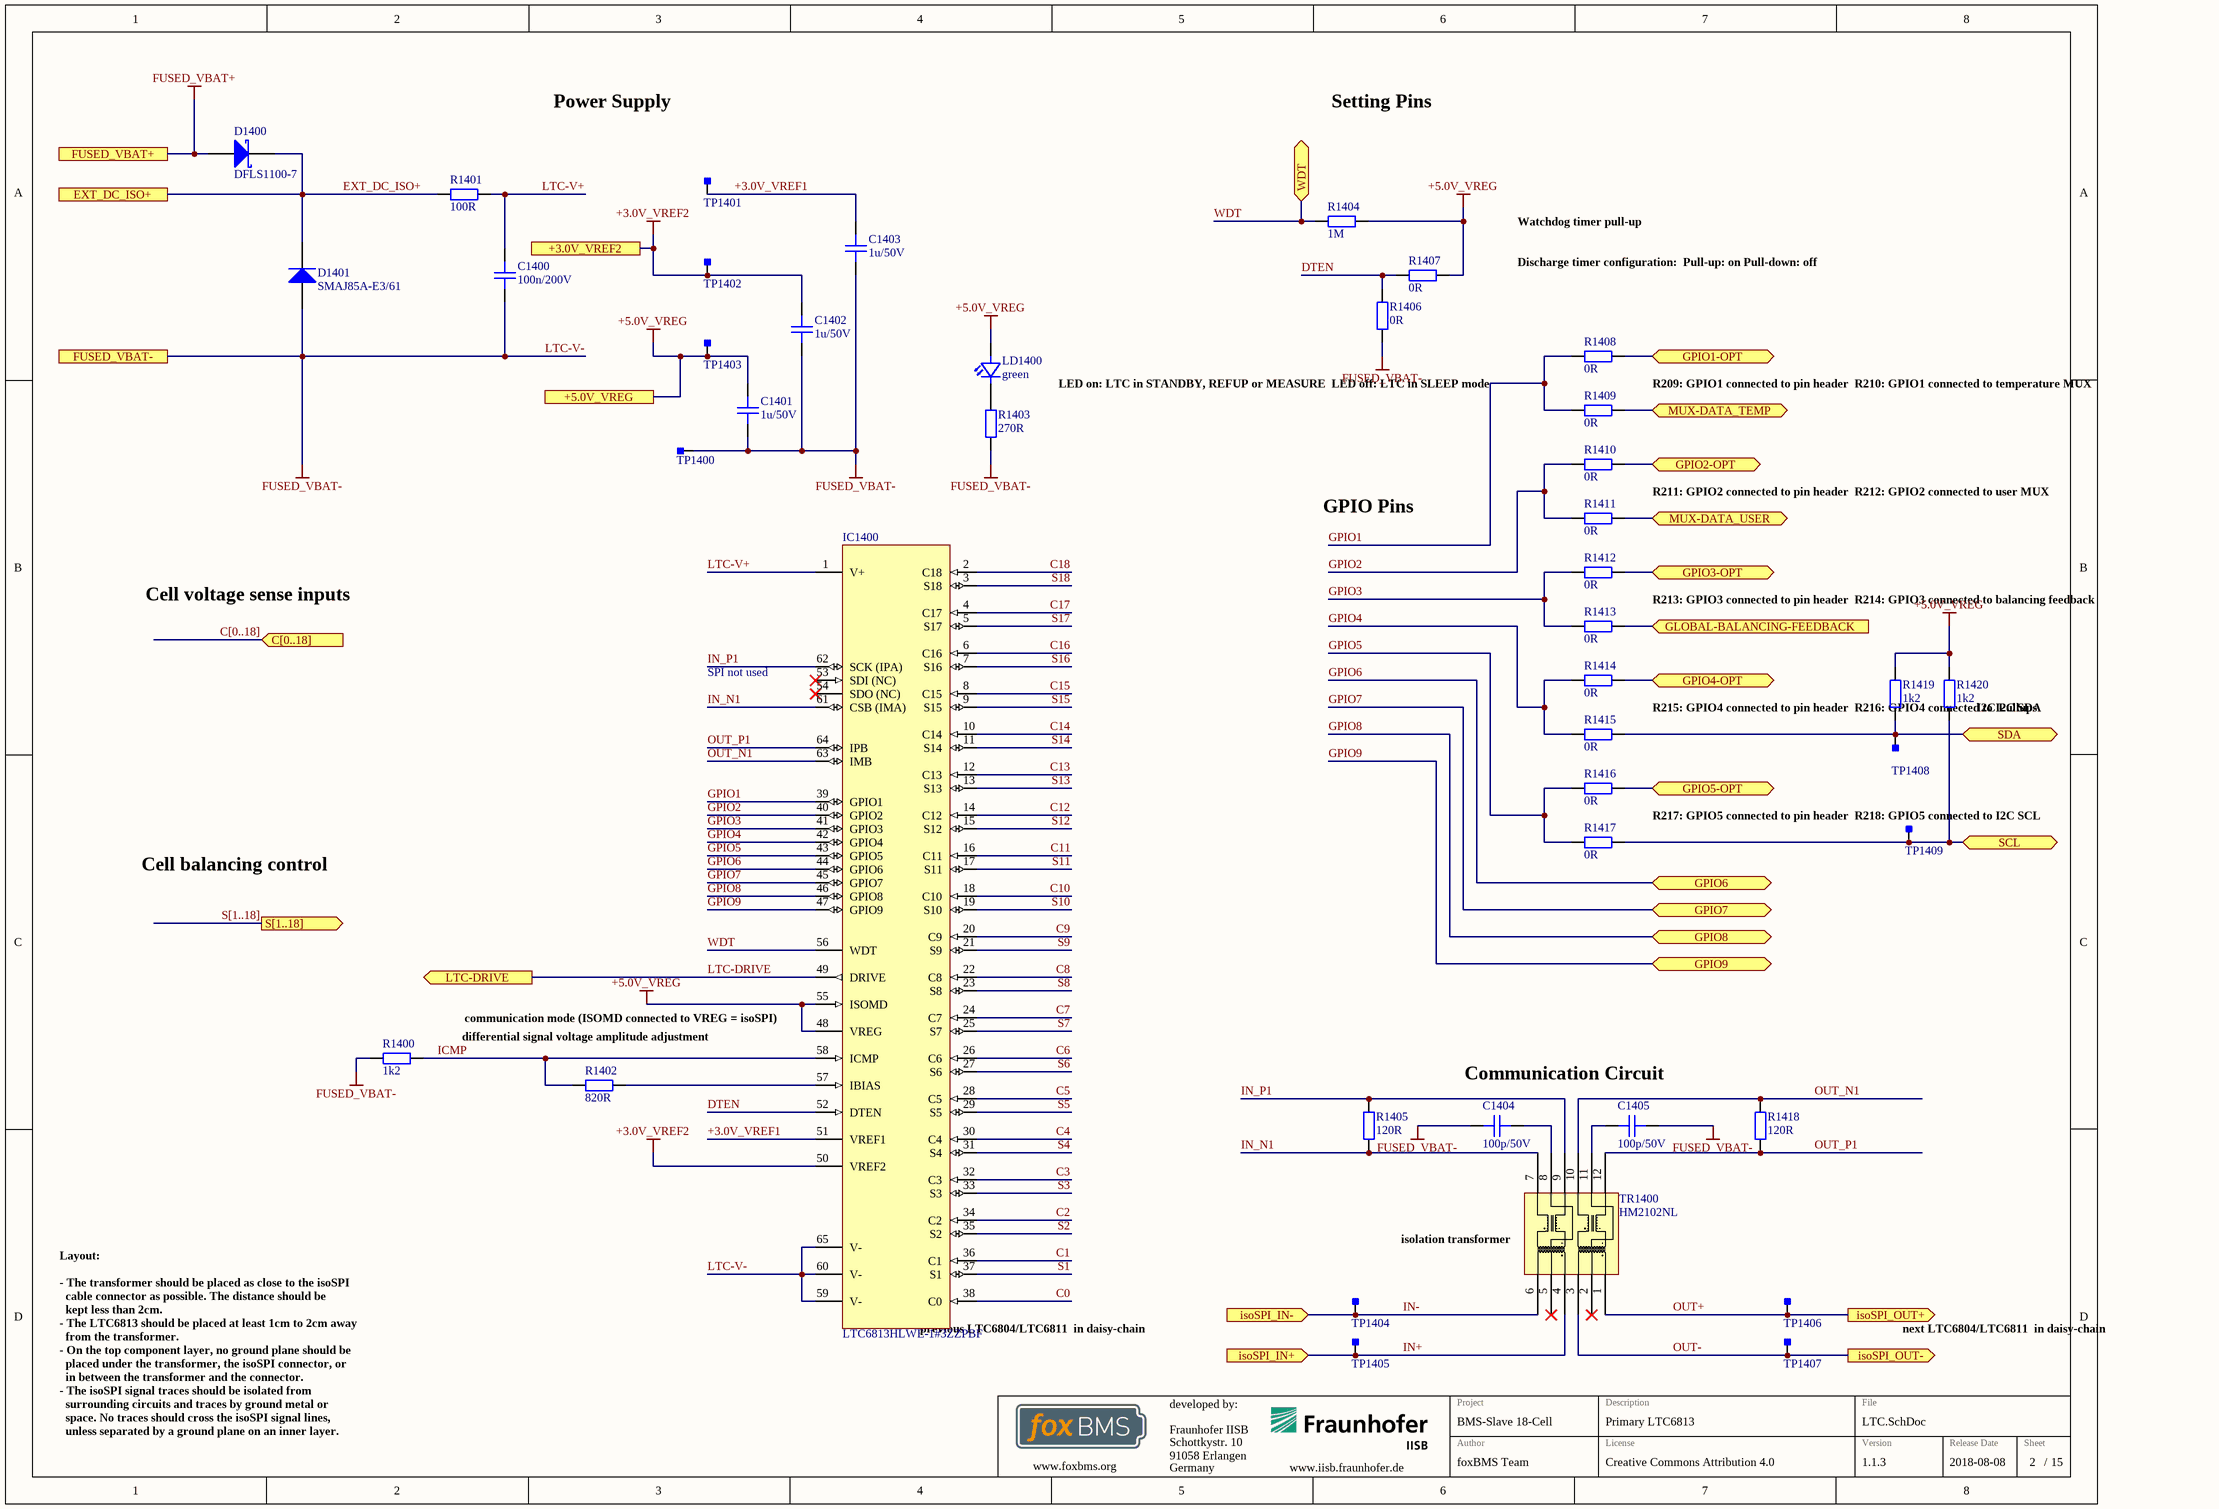
[diagram p7: LTC.SchDoc]

### Parts
C1400  100n/200V  [CAPC3216X18N]
C1401  1u/50V  [CAPC2012X14N]
C1402  1u/50V  [CAPC2012X14N]
C1403  1u/50V  [CAPC2012X14N]
C1404  100p/50V  [CAPC1608X08N]
C1405  100p/50V  [CAPC1608X08N]
D1400  DFLS1100-7  [DIOD-POWERDI123-2_V]
D1401  SMAJ85A-E3/61  [VISH-DO-214AC-2_L]
IC1400  LTC6813HLWE-1#3ZZPBF  [TSQFP50P1200X1200X160_HS-65N]
LD1400  green  [LEDC1608X07N]
R1400  1k2  [RESC1608X05N]
R1401  100R  [RESC2012X05N]
R1402  820R  [RESC1608X05N]
R1403  270R  [RESC1608X05N]
R1404  1M  [RESC1608X05N]
R1405  120R  [RESC1608X05N]
R1406  0R  [RESC1608X05N]
R1407  0R  [RESC1608X05N]
R1408  0R  [RESC1608X05N]
R1409  0R  [RESC1608X05N]
R1410  0R  [RESC1608X05N]
R1411  0R  [RESC1608X05N]
R1412  0R  [RESC1608X05N]
R1413  0R  [RESC1608X05N]
R1414  0R  [RESC1608X05N]
R1415  0R  [RESC1608X05N]
R1416  0R  [RESC1608X05N]
R1417  0R  [RESC1608X05N]
R1418  120R  [RESC1608X05N]
R1419  1k2  [RESC1608X05N]
R1420  1k2  [RESC1608X05N]
TP1400  Testpoint_Square  [Testpoint_S1]  (value not drawn)  (no BOM)
TP1401  Testpoint_Square  [Testpoint_S1]  (value not drawn)  (no BOM)
TP1402  Testpoint_Square  [Testpoint_S1]  (value not drawn)  (no BOM)
TP1403  Testpoint_Square  [Testpoint_S1]  (value not drawn)  (no BOM)
TP1404  Testpoint_Square  [Testpoint_S1]  (value not drawn)  (no BOM)
TP1405  Testpoint_Square  [Testpoint_S1]  (value not drawn)  (no BOM)
TP1406  Testpoint_Square  [Testpoint_S1]  (value not drawn)  (no BOM)
TP1407  Testpoint_Square  [Testpoint_S1]  (value not drawn)  (no BOM)
TP1408  Testpoint_Square  [Testpoint_S1]  (value not drawn)  (no BOM)
TP1409  Testpoint_Square  [Testpoint_S1]  (value not drawn)  (no BOM)
TR1400  HM2102NL  [HM2102NL]

### Ports
+3.0V_VREF2, +5.0V_VREG, C[0..18] (in), EXT_DC_ISO+, FUSED_VBAT+, FUSED_VBAT-, GLOBAL-BALANCING-FEEDBACK (in), GPIO1-OPT (bidir), GPIO2-OPT (bidir), GPIO3-OPT (bidir), GPIO4-OPT (bidir), GPIO5-OPT (bidir), GPIO6 (bidir), GPIO7 (bidir), GPIO8 (bidir), GPIO9 (bidir), isoSPI_IN+ (in), isoSPI_IN- (in), isoSPI_OUT+ (out), isoSPI_OUT- (out), LTC-DRIVE (out), MUX-DATA_TEMP (bidir), MUX-DATA_USER (bidir), S[1..18] (out), SCL (bidir), SDA (bidir), WDT (bidir)

### Nets
+3.0V_VREF2: C1402.2 IC1400.50(VREF2) TP1402.1 ; port +3.0V_VREF2
+5.0V_VREG: C1401.2 IC1400.48(VREG) IC1400.55(ISOMD) LD1400.2(A) R1404.2 R1407.2 R1419.2 R1420.2 TP1403.1 ; port +5.0V_VREG
FUSED_VBAT+: D1400.1(A) ; port FUSED_VBAT+
FUSED_VBAT-: C1400.2 C1401.1 C1402.1 C1403.1 C1404.1 C1405.1 D1401.2(A) IC1400.59(V-) IC1400.60(V-) IC1400.65(V-) R1400.1 R1403.1 R1406.1 TP1400.1 ; port FUSED_VBAT-  [also labelled LTC-V-]
+3.0V_VREF1: C1403.2 IC1400.51(VREF1) TP1401.1
C0: IC1400.38(C0)
C1: IC1400.36(C1)
C2: IC1400.34(C2)
C3: IC1400.32(C3)
C4: IC1400.30(C4)
C5: IC1400.28(C5)
C6: IC1400.26(C6)
C7: IC1400.24(C7)
C8: IC1400.22(C8)
C9: IC1400.20(C9)
C10: IC1400.18(C10)
C11: IC1400.16(C11)
C12: IC1400.14(C12)
C13: IC1400.12(C13)
C14: IC1400.10(C14)
C15: IC1400.8(C15)
C16: IC1400.6(C16)
C17: IC1400.4(C17)
C18: IC1400.2(C18)
DTEN: IC1400.52(DTEN) R1406.2 R1407.1
EXT_DC_ISO+: D1400.2(K) D1401.1(K) R1401.1 ; port EXT_DC_ISO+
GLOBAL-BALANCING-FEEDBACK: R1413.1 ; port GLOBAL-BALANCING-FEEDBACK
GPIO1: IC1400.39(GPIO1) R1408.2 R1409.2
GPIO1-OPT: R1408.1 ; port GPIO1-OPT
GPIO2: IC1400.40(GPIO2) R1410.2 R1411.2
GPIO2-OPT: R1410.1 ; port GPIO2-OPT
GPIO3: IC1400.41(GPIO3) R1412.2 R1413.2
GPIO3-OPT: R1412.1 ; port GPIO3-OPT
GPIO4: IC1400.42(GPIO4) R1414.2 R1415.2
GPIO4-OPT: R1414.1 ; port GPIO4-OPT
GPIO5: IC1400.43(GPIO5) R1416.2 R1417.2
GPIO5-OPT: R1416.1 ; port GPIO5-OPT
GPIO6: IC1400.44(GPIO6) ; port GPIO6
GPIO7: IC1400.45(GPIO7) ; port GPIO7
GPIO8: IC1400.46(GPIO8) ; port GPIO8
GPIO9: IC1400.47(GPIO9) ; port GPIO9
ICMP: IC1400.58(ICMP) R1400.2 R1402.1
IN+: TP1405.1 TR1400.4 ; port isoSPI_IN+
IN-: TP1404.1 TR1400.6 ; port isoSPI_IN-
IN_N1: IC1400.61(CSB_(IMA)) R1405.2 TR1400.7
IN_P1: IC1400.62(SCK_(IPA)) R1405.1 TR1400.9
LTC-DRIVE: IC1400.49(DRIVE) ; port LTC-DRIVE
LTC-V+: C1400.1 IC1400.1(V+) R1401.2
MUX-DATA_TEMP: R1409.1 ; port MUX-DATA_TEMP
MUX-DATA_USER: R1411.1 ; port MUX-DATA_USER
OUT+: TP1406.1 TR1400.1 ; port isoSPI_OUT+
OUT-: TP1407.1 TR1400.3 ; port isoSPI_OUT-
OUT_N1: IC1400.63(IMB) R1418.2 TR1400.10
OUT_P1: IC1400.64(IPB) R1418.1 TR1400.12
S1: IC1400.37(S1)
S2: IC1400.35(S2)
S3: IC1400.33(S3)
S4: IC1400.31(S4)
S5: IC1400.29(S5)
S6: IC1400.27(S6)
S7: IC1400.25(S7)
S8: IC1400.23(S8)
S9: IC1400.21(S9)
S10: IC1400.19(S10)
S11: IC1400.17(S11)
S12: IC1400.15(S12)
S13: IC1400.13(S13)
S14: IC1400.11(S14)
S15: IC1400.9(S15)
S16: IC1400.7(S16)
S17: IC1400.5(S17)
S18: IC1400.3(S18)
SCL: R1417.1 R1420.1 TP1409.1 ; port SCL
SDA: R1415.1 R1419.1 TP1408.1 ; port SDA
WDT: IC1400.56(WDT) R1404.1 ; port WDT
NetC1404_2: C1404.2 TR1400.8
NetC1405_2: C1405.2 TR1400.11
NetIC1400_57: IC1400.57(IBIAS) R1402.2
NetLD1400_1: LD1400.1(C) R1403.2

Not connected (* = marked no-connect by the designer): IC1400 53(SDI_(NC))* 54(SDO_(NC))*; TR1400 2* 5*

### Channels
U_primary_LTC: designators end in _1; ports +3.0V_VREF2=+3.0V_VREF2 +5.0V_VREG=+5.0V_VREG EXT_DC_ISO+=EXT_DC_ISO+ FUSED_VBAT+=FUSED_VBAT+ FUSED_VBAT-=FUSED_VBAT- GLOBAL-BALANCING-FEEDBACK=GLOBAL-BAL-FB GPIO1-OPT=PRIMARY-GPIO1-OPT GPIO2-OPT=PRIMARY-GPIO2-OPT GPIO3-OPT=PRIMARY-GPIO3-OPT GPIO4-OPT=PRIMARY-GPIO4-OPT GPIO5-OPT=PRIMARY-GPIO5-OPT GPIO6=PRIMARY-GPIO6 GPIO7=PRIMARY-GPIO7 GPIO8=PRIMARY-GPIO8 GPIO9=PRIMARY-GPIO9 isoSPI_IN+=PRIMARY-IN+ isoSPI_IN-=PRIMARY-IN- isoSPI_OUT+=PRIMARY-OUT+ isoSPI_OUT-=PRIMARY-OUT- LTC-DRIVE=PRIMARY-LTC-DRIVE MUX-DATA_TEMP=PRIMARY-MUX-DATA_TEMP MUX-DATA_USER=PRIMARY-MUX-DATA_USER SCL=PRIMARY-SCL SDA=PRIMARY-SDA WDT=PRIMARY-WDT
U_secondary_LTC: designators end in _2; ports +3.0V_VREF2=+3.0V_VREF2 +5.0V_VREG=+5.0V_VREG EXT_DC_ISO+=EXT_DC_ISO+ FUSED_VBAT+=FUSED_VBAT+ FUSED_VBAT-=FUSED_VBAT- GLOBAL-BALANCING-FEEDBACK=GLOBAL-BAL-FB GPIO1-OPT=SECONDARY-GPIO1-OPT GPIO2-OPT=SECONDARY-GPIO2-OPT GPIO3-OPT=SECONDARY-GPIO3-OPT GPIO4-OPT=SECONDARY-GPIO4-OPT GPIO5-OPT=SECONDARY-GPIO5-OPT GPIO6=SECONDARY-GPIO6 GPIO7=SECONDARY-GPIO7 GPIO8=SECONDARY-GPIO8 GPIO9=SECONDARY-GPIO9 isoSPI_IN+=SECONDARY-IN+ isoSPI_IN-=SECONDARY-IN- isoSPI_OUT+=SECONDARY-OUT+ isoSPI_OUT-=SECONDARY-OUT- LTC-DRIVE=SECONDARY-LTC-DRIVE MUX-DATA_TEMP=SECONDARY-MUX-DATA_TEMP MUX-DATA_USER=SECONDARY-MUX-DATA_USER SCL=SECONDARY-SCL SDA=SECONDARY-SDA WDT=SECONDARY-WDT

### Buses and harness runs
bus C[0..18] = port C[0..18]
bus S[1..18] = port S[1..18]

### Notes on the sheet
- Power Supply
- Setting Pins
- Watchdog timer pull-up
- Discharge timer configuration:
  Pull-up: on
  Pull-down: off
- LED on: LTC in STANDBY, REFUP or MEASURE
  LED off: LTC in SLEEP mode
- R209: GPIO1 connected to pin header
  R210: GPIO1 connected to temperature MUX
- GPIO Pins
- R211: GPIO2 connected to pin header
  R212: GPIO2 connected to user MUX
- Cell voltage sense inputs
- R213: GPIO3 connected to pin header
  R214: GPIO3 connected to balancing feedback
- SPI not used
- R215: GPIO4 connected to pin header
  R216: GPIO4 connected to I2C SDA
- (near R1420) I2C Pullups
- (near TP1409) R217: GPIO5 connected to pin header
  R218: GPIO5 connected to I2C SCL
- Cell balancing control
- communication mode (ISOMD connected to VREG = isoSPI)
- differential signal voltage amplitude adjustment
- Communication Circuit
- (near TR1400) isolation transformer
- (near TP1405) previous LTC6804/LTC6811
  in daisy-chain
- next LTC6804/LTC6811
  in daisy-chain
- Layout:
  - The transformer should be placed as close to the isoSPI
  cable connector as possible. The distance should be
  kept less than 2cm.
  - The LTC6813 should be placed at least 1cm to 2cm away
  from the transformer.
  - On the top component layer, no ground plane should be
  placed under the transformer, the isoSPI connector, or
  in between the transformer and the connector.
  - The isoSPI signal traces should be isolated from
  surrounding circuits and traces by ground metal or
  space. No traces should cross the isoSPI signal lines,
  unless separated by a ground plane on an inner layer.
- Fraunhofer IISB
- Schottkystr. 10
- developed by:
- 91058 Erlangen
- Germany
- Author
- Project
- License
- Description
- File
- Version
- Release Date
- Sheet
- www.foxbms.org
- www.iisb.fraunhofer.de
- foxBMS Team
- /

### Library data of the parts
C1400 = gen_C_ceramic_100n_200V_X7R_1206: MLCC; Capacitance: 100n; Rated Voltage: 200V; Dielectric: X7R; Case EIA: 1206; Case Metric: 3216; Automotive Qualified: True; Part Number: gen_C_ceramic_100n_200V_X7R_1206; Supplier 1: Farnell; Supplier Part Number 1: 2673161; Supplier 2: Farnell; Supplier Part Number 2: 2520773
C1401-C1403 = gen_C_ceramic_1u_50V_X7R_0805: MLCC; Capacitance: 1u; Rated Voltage: 50V; Dielectric: X7R; Case EIA: 0805; Case Metric: 2012; Automotive Qualified: True; Tolerance: ± 10%; AVT Set: x; Part Number: gen_C_ceramic_1u_50V_X7R_0805; Supplier 1: Farnell; Supplier Part Number 1: 2672199; Operating Temperature: -55°C - +125°C; Supplier 2: Farnell; Supplier Part Number 2: 2479894; Supplier 3: Farnell; Supplier Part Number 3: 2464630
C1404 C1405 = gen_C_ceramic_100p_50V_C0G_0603: MLCC; Capacitance: 100p; Rated Voltage: 50V; Dielectric: C0G; Case EIA: 0603; Case Metric: 1608; Automotive Qualified: True; Tolerance: ± 10%; Part Number: gen_C_ceramic_100p_50V_C0G_0603; Supplier 1: Farnell; Supplier Part Number 1: 2478236
D1400 = CMP-2000-05099-1: 1 A High Voltage Schottky Barrier Rectifier, 0.62 V, -55 to 175 degC, 2- Pin POWERDI123, Pb-Free, Tape and Reel; Manufacturer: Diodes Inc; Average Rectified Current-Max: 1A; Peak Current-Max: 40A; Forward Voltage: 0.77V; Reverse Current-Max: 1µA; Reverse Voltage-Max [Vrrm]: 100V; Datasheet Version: Sep-14; Datasheet URL: https://datasheet.ciiva.com/15144/getdatasheetpartid-44146-15144126.pdf; Manufacturer URL: http://www.diodes.com/
D1401 = CMP-0548-00243-2: Transient Voltage Suppressor, 6.40 to 231 V, 85 V Stand-off Voltage, Uni-Directional, -55 to 155 degC, 2-pin DO-214AC, Pb-Free, Tape and Reel; Manufacturer: Vishay Semiconductor; VWM (V): 85; PPPM (W): 400, 300; VBR Uni-Directional (V): 6.4 to 231; IFSM: 40 A; ID (uA): 1; RoHS: TRUE; ComponentLink3Description: Package Specification; PackageReference: DO-214AC-2; PartNumber: SMAJ85A-E3/61; ComponentLink2Description: Datasheet; ComponentLink2URL: http://www.vishay.com/docs/88390/smaj50a.pdf; ComponentLink3URL: http://www.vishay.com/docs/88390/smaj50a.pdf; Packing: Tape and Reel; ComponentLink1Description: Manufacturer URL; PackageDescription: 2-Pin DO-214AC (SMA), Body 4.245 x 2.665 mm; DatasheetVersion: 12/8/2013; ComponentLink1URL: http://www.vishay.com/; Operating Junction and Storage Temperature Range: -55 to 150 degC; Mounting Technology: Surface Mount
IC1400 = LTC6813HLWE-1#3ZZPBF: 18 Cell Multicell Battery Monitor, -40 to 125 degC, Pb-Free; PartNumber: LTC6811HG-1#PBF; Manufacturer: Linear Technology; Type of Charger: Battery Stack Monitor; Vin Max(V): 60; Battery Chemistry: Li-Ion, Li-Polymer, NiMH; Number of Cells: > 1000 V of stacked Li-Ion cells; Automotive Qualified: True; PnP Package: QFP-64; RoHS: TRUE; ComponentLink1Description: Datasheet; ComponentLink1URL: http://www.linear.com/docs/59387; PackageReference: G-48; PackageVersion: Rev. Ã˜, 01/2011; ComponentLink2Description: Datasheet; Mounting Technology: Surface Mount; ComponentLink3Description: Package Specification; PackageDescription: 48-Pin Plastic SSOP, Body 12.8 x 5.3 mm, Pitch 0.5 mm; ComponentLink3URL: http://cds.linear.com/docs/en/packaging/05081887_0_G48.pdf; ComponentLink2URL: http://cds.linear.com/docs/en/datasheet/680412f.pdf; Part Number: LTC6813HLWE-1#3ZZPBF; Part Name: LTC6813HLWE-1#3ZZPBF; Operating Temperature: -40°C - +125°C; Supplier 1: Digikey; Supplier Part Number 1: LTC6813HLWE-1#3ZZPBF-ND
LD1400 = LED_0603_green_AECQ: TLMG1100-GS08; Manufacturer: Vishay; Breakdown Voltage: 5V; Continuous Forward Current: 20mA; Forward Voltage @ 20mA: 2.1V; Automotive Qualified: True; Part Number: LED_0603_green_AECQ; Color: green; Supplier 1: Farnell; Supplier Part Number 1: 2293494; PnP Package: LED_0603; Operating Temperature: -40°C - 100°C; ComponentLink1Description: Datasheet; ComponentLink1URL: http://www.farnell.com/datasheets/2049164.pdf; Supplier 2: Digikey; Supplier Part Number 2: 751-1165-1-ND
R1400 R1419 R1420 = gen_R_1k2_0603: SMD Resistor 1k2 0603; Tolerance: 1%; Power: 0.1W; Case EIA: 0603; Case Metric: 1608; Maximum Working Voltage: 75V; PnP Package: R_0603; Automotive Qualified: True; Part Number: gen_R_1k2_0603; Operating Temperature: -55°C - +155°C; Resistance: 1k2; Series: E24; PnP Value: 1k2; Supplier 1: Farnell; Supplier Part Number 1: 2073370
R1401 = gen_R_100R_0805: SMD Resistor 100R 0805; Tolerance: 1%; Power: 0.125W; Case EIA: 0805; Case Metric: 2012; Maximum Working Voltage: 150V; PnP Package: R_0805; Automotive Qualified: True; Part Number: gen_R_100R_0805; Operating Temperature: -55°C - +155°C; Resistance: 100R; Series: E24, E96; PnP Value: 100R; Supplier 1: Farnell; Supplier Part Number 1: 1469862
R1402 = gen_R_820R_0603: SMD Resistor 820R 0603; Tolerance: 1%; Power: 0.1W; Case EIA: 0603; Case Metric: 1608; Maximum Working Voltage: 75V; PnP Package: R_0603; Automotive Qualified: True; Part Number: gen_R_820R_0603; Operating Temperature: -55°C - +155°C; Resistance: 820R; Series: E24; PnP Value: 820R; Supplier 1: Farnell; Supplier Part Number 1: 1469841
R1403 = gen_R_270R_0603: SMD Resistor 270R 0603; Tolerance: 1%; Power: 0.1W; Case EIA: 0603; Case Metric: 1608; Maximum Working Voltage: 75V; PnP Package: R_0603; Automotive Qualified: True; Part Number: gen_R_270R_0603; Operating Temperature: -55°C - +155°C; Resistance: 270R; Series: E24; PnP Value: 270R; Supplier 1: Farnell; Supplier Part Number 1: 2141320
R1404 = gen_R_1M_0603: SMD Resistor 1M 0603; Tolerance: 1%; Power: 0.1W; Case EIA: 0603; Case Metric: 1608; Maximum Working Voltage: 75V; PnP Package: R_0603; Automotive Qualified: True; Part Number: gen_R_1M_0603; Operating Temperature: -55°C - +155°C; Resistance: 1M; Series: E24, E96; PnP Value: 1M; Supplier 1: Farnell; Supplier Part Number 1: 1469746
R1405 R1418 = gen_R_120R_0603: SMD Resistor 120R 0603; Tolerance: 1%; Power: 0.1W; Case EIA: 0603; Case Metric: 1608; Maximum Working Voltage: 75V; PnP Package: R_0603; Automotive Qualified: True; Part Number: gen_R_120R_0603; Operating Temperature: -55°C - +155°C; Resistance: 120R; Series: E24; PnP Value: 120R; Supplier 1: Farnell; Supplier Part Number 1: 1652832
R1406-R1417 = gen_R_0R_0603: SMD Resistor 0R 0603; Power: 0.1W; Case EIA: 0603; Case Metric: 1608; Maximum Working Voltage: 75V; PnP Package: R_0603; Automotive Qualified: True; Part Number: gen_R_0R_0603; Operating Temperature: -55°C - +155°C; Resistance: 0R; Series: Jumper; PnP Value: 0R; Supplier 1: Farnell; Supplier Part Number 1: 2616580
TP1400-TP1409 = Testpoint_Square: Testpoint, square; Part Number: Testpoint_Square
TR1400 = HM2102NL: Pulse HM2102NL BMS Transformer; Automotive Qualified: True; Part Number: HM2102NL; Manufacturer: Pulse; Operating Temperature: -40°C - +125°C; ComponentLink1Description: Datasheet; ComponentLink1URL: https://www.mouser.com/ds/2/336/HM2102NL-1218600.pdf; Supplier 1: Mouser; Supplier Part Number 1: 673-HM2102NL; Supplier 2: Digikey; Supplier Part Number 2: 1840-1034-1-ND

## Sheet digital_io.SchDoc: foxBMS BMS-Slave 12-Cell
size A3; DocumentNumber: 8; SheetNumber: 8; SheetTotal: 15; AUTHOR: Fraunhofer IISB foxBMS Team; SheetDescription: Primary Digital Inputs/Outputs
Used 2 times, as channels U_secondary_digital_io, U_primary_digital_io. Parts and nets are listed once, with the designators drawn on the sheet.
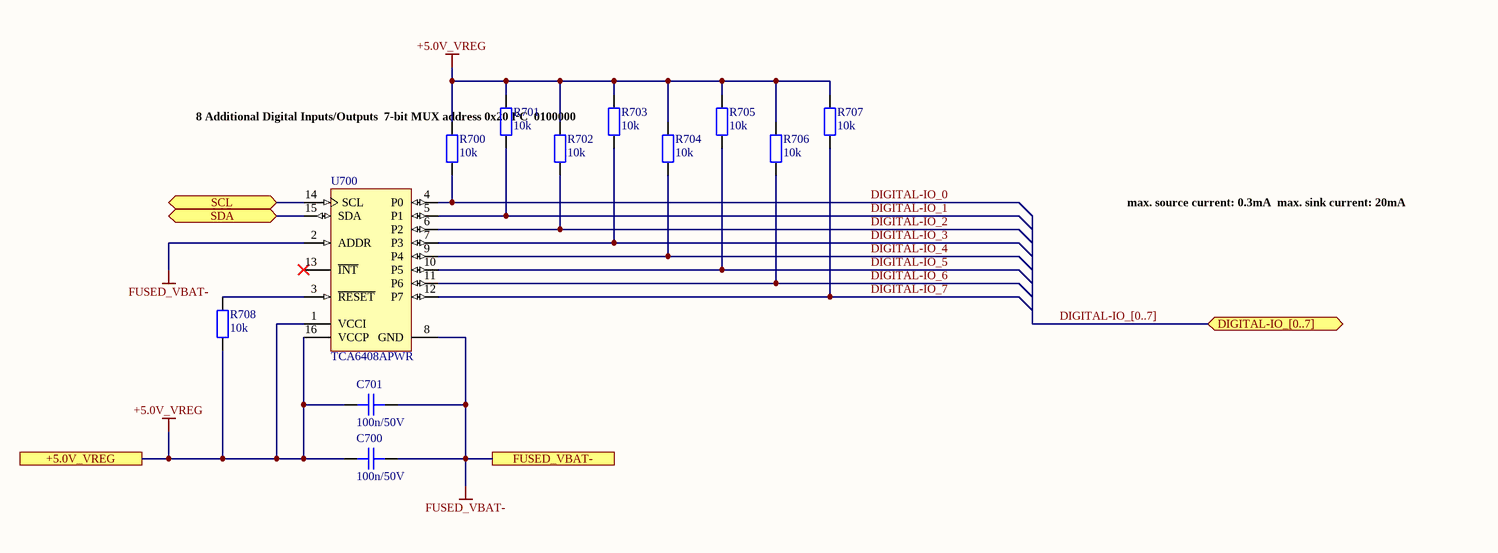
[diagram p8: digital_io.SchDoc]

### Parts
C700  100n/50V  [CAPC1608X08N]
C701  100n/50V  [CAPC1608X08N]
R700  10k  [RESC1608X05N]
R701  10k  [RESC1608X05N]
R702  10k  [RESC1608X05N]
R703  10k  [RESC1608X05N]
R704  10k  [RESC1608X05N]
R705  10k  [RESC1608X05N]
R706  10k  [RESC1608X05N]
R707  10k  [RESC1608X05N]
R708  10k  [RESC1608X05N]
U700  TCA6408APWR  [PW0016A_L]

### Ports
+5.0V_VREG, DIGITAL-IO_[0..7] (bidir), FUSED_VBAT-, SCL (bidir), SDA (bidir)

### Nets
+5.0V_VREG: C700.2 C701.2 R700.2 R701.2 R702.2 R703.2 R704.2 R705.2 R706.2 R707.2 R708.1 U700.1(VCCI) U700.16(VCCP) ; port +5.0V_VREG
FUSED_VBAT-: C700.1 C701.1 U700.2(ADDR) U700.8(GND) ; port FUSED_VBAT-
DIGITAL-IO_0: R700.1 U700.4(P0)
DIGITAL-IO_1: R701.1 U700.5(P1)
DIGITAL-IO_2: R702.1 U700.6(P2)
DIGITAL-IO_3: R703.1 U700.7(P3)
DIGITAL-IO_4: R704.1 U700.9(P4)
DIGITAL-IO_5: R705.1 U700.10(P5)
DIGITAL-IO_6: R706.1 U700.11(P6)
DIGITAL-IO_7: R707.1 U700.12(P7)
SCL: U700.14(SCL) ; port SCL
SDA: U700.15(SDA) ; port SDA
NetR708_2: R708.2 U700.3(~{RESET})

Not connected (* = marked no-connect by the designer): U700 13(~{INT})*

### Channels
U_secondary_digital_io: designators end in _1; ports +5.0V_VREG=+5.0V_VREG FUSED_VBAT-=FUSED_VBAT- SCL=SECONDARY-SCL SDA=SECONDARY-SDA
U_primary_digital_io: designators end in _2; ports +5.0V_VREG=+5.0V_VREG FUSED_VBAT-=FUSED_VBAT- SCL=PRIMARY-SCL SDA=PRIMARY-SDA

### Buses and harness runs
bus DIGITAL-IO_[0..7] = port DIGITAL-IO_[0..7]

### Notes on the sheet
- 8 Additional Digital Inputs/Outputs
  7-bit MUX address 0x20 I²C
  0100000
- max. source current: 0.3mA
  max. sink current: 20mA
- Fraunhofer IISB
- Schottkystr. 10
- developed by:
- 91058 Erlangen
- Germany
- Author
- Project
- License
- Description
- File
- Version
- Release Date
- Sheet
- www.foxbms.org
- www.iisb.fraunhofer.de
- foxBMS Team
- /

### Library data of the parts
C700 C701 = gen_C_ceramic_100n_50V_X7R_0603: MLCC; Capacitance: 100n; Rated Voltage: 50V; Dielectric: X7R; Case EIA: 0603; Case Metric: 1608; PnP Package: C_0603_10; PnP Value: 100n/50V/X7R; PnP equipped: x; Automotive Qualified: True; Part Number: gen_C_ceramic_100n_50V_X7R_0603; Supplier 1: Farnell; Supplier Part Number 1: 2525267; Supplier 2: Digikey; Supplier Part Number 2: 490-6049-1-ND; Supplier 3: Farnell; Supplier Part Number 3: 2070398
R700-R708 = gen_R_10k_0603: SMD Resistor 10k 0603; Tolerance: 1%; Power: 0.1W; Case EIA: 0603; Case Metric: 1608; Maximum Working Voltage: 75V; PnP Package: R_0603; Automotive Qualified: True; Part Number: gen_R_10k_0603; Operating Temperature: -55°C - +155°C; Resistance: 10k; Series: E24, E96; PnP Value: 10k; Supplier 1: Farnell; Supplier Part Number 1: 2073349
U700 = CMP-0314-00338-2: Low-Voltage 8-Bit I2C and SMBus I/O Expander, 1.65 to 5.5 V, -40 to 85 degC, 16-pin TSSOP (PW), Green (RoHS & no Sb/Br); Manufacturer: Texas Instruments; Push-Pull I/O Type: Yes; Max Frequency(kHz): 400; No. of Outputs: 8; VCC(Min)(V): 1.65; SubFamily: I2C IO Expander; I2C Address: 0100 00x; VCC(Max)(V): 5.5; Vcc range(V): 1.65 to 5.5; PackageDescription: 16-Pin Plastic Thin Small Outline Package 5 x 4.4 mm Body ,0.65 mm Pitch; PartNumber: TCA6408APWR; Configuration Registers: Yes; Eco-Plan: Green (RoHS & no Sb/Br); ComponentLink1Description: Datasheet; Low Power: Yes; ComponentLink1URL: http://www.ti.com/general/docs/lit/getliterature.tsp?genericPartNumber=TCA6408A&fileType=pdf; 5V Tolerant I/O: Yes; Code_JEDEC: MO-153; Interrupt Output: Yes; PackageVersion: revG, Feb-2011; # of I/Os: 8; Reset Input: Yes; fSCLK(Max)(MHz): 400; PackageReference: PW0016A; Mounting Technology: Surface Mount; DatasheetVersion: SCPS192C

## Sheet eeprom_temp_sens.SchDoc: foxBMS BMS-Slave 12-Cell
size A3; DocumentNumber: 9; SheetNumber: 9; SheetTotal: 15; AUTHOR: Fraunhofer IISB foxBMS Team; SheetDescription: Primary EEPROM and Board T-Sensor
Used 2 times, as channels U_secondary_eeprom_temp_sens, U_primary_eeprom_temp_sens. Parts and nets are listed once, with the designators drawn on the sheet.
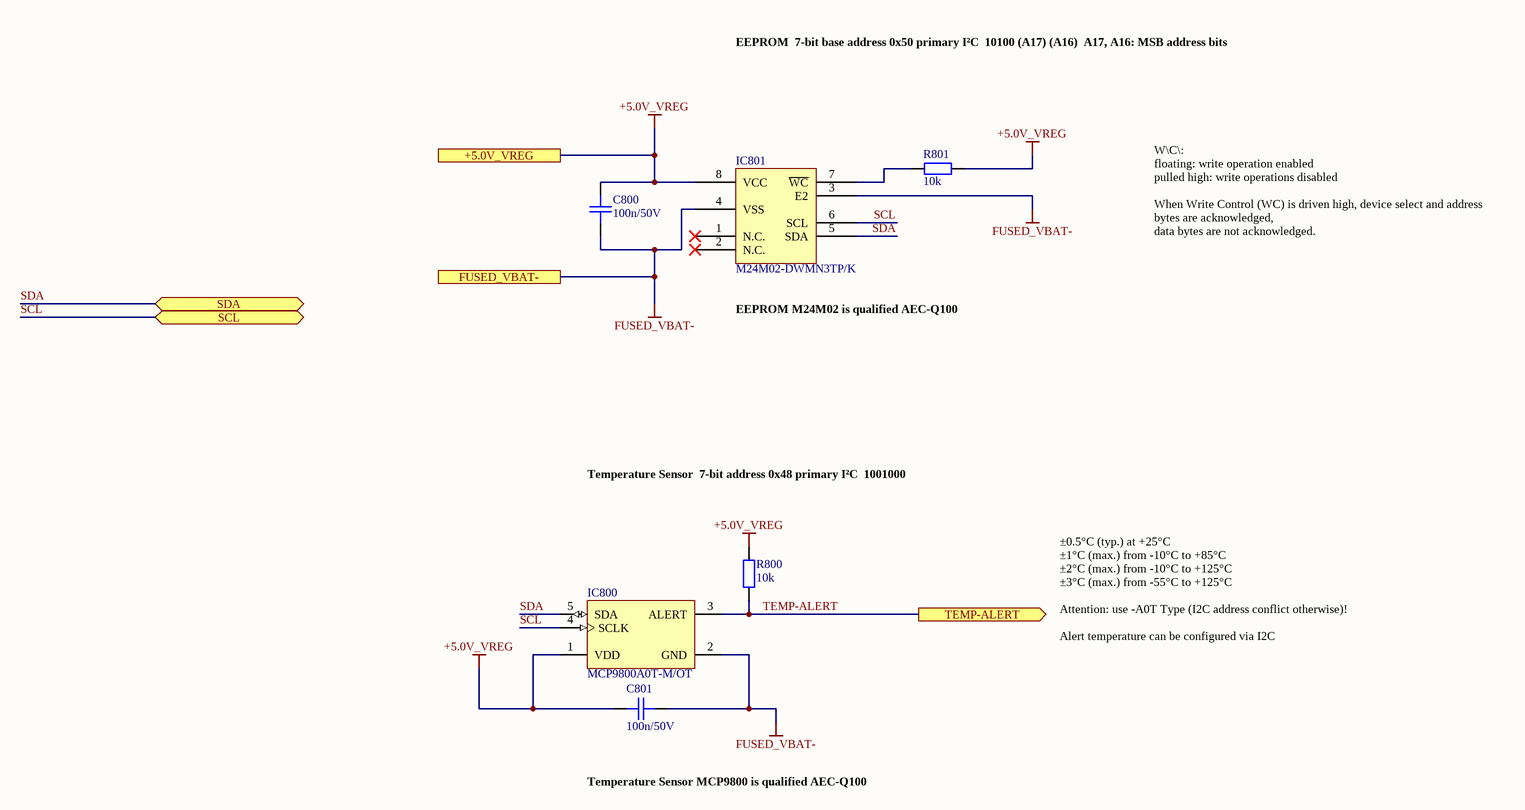
[diagram p9: eeprom_temp_sens.SchDoc]

### Parts
C800  100n/50V  [CAPC1608X08N]
C801  100n/50V  [CAPC1608X08N]
IC800  MCP9800A0T-M/OT  [SOT-23-OT5_L]
IC801  M24M02-DWMN3TP/K  [SOIC127P600X175-8N]
R800  10k  [RESC1608X05N]
R801  10k  [RESC1608X05N]

### Ports
+5.0V_VREG, FUSED_VBAT-, SCL (bidir), SDA (bidir), TEMP-ALERT (out)

### Nets
+5.0V_VREG: C800.2 C801.2 IC800.1(VDD) IC801.8(VCC) R800.2 R801.2 ; port +5.0V_VREG
FUSED_VBAT-: C800.1 C801.1 IC800.2(GND) IC801.3(E2) IC801.4(VSS) ; port FUSED_VBAT-
SCL: IC800.4(SCLK) IC801.6(SCL) ; port SCL
SDA: IC800.5(SDA) IC801.5(SDA) ; port SDA
TEMP-ALERT: IC800.3(ALERT) R800.1 ; port TEMP-ALERT
NetIC801_7: IC801.7(~{WC}) R801.1

Not connected (* = marked no-connect by the designer): IC801 1(N.C.)* 2(N.C.)*

### Channels
U_secondary_eeprom_temp_sens: designators end in _1; ports +5.0V_VREG=+5.0V_VREG FUSED_VBAT-=FUSED_VBAT- SCL=SECONDARY-SCL SDA=SECONDARY-SDA TEMP-ALERT=SECONDARY-TEMP-ALERT
U_primary_eeprom_temp_sens: designators end in _2; ports +5.0V_VREG=+5.0V_VREG FUSED_VBAT-=FUSED_VBAT- SCL=PRIMARY-SCL SDA=PRIMARY-SDA TEMP-ALERT=PRIMARY-TEMP-ALERT

### Notes on the sheet
- EEPROM
  7-bit base address 0x50 primary I²C
  10100 (A17) (A16)
  A17, A16: MSB address bits
- W\C\:
  floating: write operation enabled
  pulled high: write operations disabled
  When Write Control (WC) is driven high, device select and address bytes are acknowledged,
  data bytes are not acknowledged.
- EEPROM M24M02 is qualified AEC-Q100
- Temperature Sensor
  7-bit address 0x48 primary I²C
  1001000
- ±0.5°C (typ.) at +25°C
  ±1°C (max.) from -10°C to +85°C
  ±2°C (max.) from -10°C to +125°C
  ±3°C (max.) from -55°C to +125°C
  Attention: use -A0T Type (I2C address conflict otherwise)!
  Alert temperature can be configured via I2C
- Temperature Sensor MCP9800 is qualified AEC-Q100
- Fraunhofer IISB
- Schottkystr. 10
- developed by:
- 91058 Erlangen
- Germany
- Author
- Project
- License
- Description
- File
- Version
- Release Date
- Sheet
- www.foxbms.org
- www.iisb.fraunhofer.de
- foxBMS Team
- /

### Library data of the parts
C800 C801 = gen_C_ceramic_100n_50V_X7R_0603: as C700 on sheet digital_io; Part Number: gen_C_ceramic_100n_50V_X7R_0603; Supplier 1: Farnell; Supplier Part Number 1: 2525267; Supplier 2: Digikey; Supplier Part Number 2: 490-6049-1-ND; Supplier 3: Farnell; Supplier Part Number 3: 2070398
IC800 = CMP-0192-00211-1: 2-Wire High-Accuracy Temperature Sensor, Slave Address 000, 5-Pin SOT-23, -55°C to +125°C Temperature, Tape and Reel; PackageReference: SOT-23-OT5; PackageVersion: revBB, Aug-2009; DatasheetVersion: revD, Nov-2010; PackageDescription: 5-Lead Plastic Small Outline Transistor (OT) [SOT-23]; Code_IPC: SOT23-5
IC801 = M24M02-DWMN3TP/K: Automotive 2-Mbit serial I²C / bus EEPROM with 1 MHz clock; Manufacturer: STMicroelectronics; PnP Package: SO8N; Automotive Qualified: True; Part Number: M24M02-DWMN3TP/K; Part Name: M24M02-DWMN3TP/K; Operating Temperature: -40°C - +125°C; ComponentLink1Description: Datasheet; ComponentLink1URL: http://www.st.com/content/ccc/resource/technical/document/datasheet/83/f4/3e/e4/4e/49/42/c5/DM00200595.pdf/files/DM00200595.pdf/jcr:content/translations/en.DM00200595.pdf; Supplier 1: Digikey; Supplier Part Number 1: 497-16238-1-ND; Supplier 2: Mouser; Supplier Part Number 2: 511-M24M02-DWMN3TP/K; Supplier 3: Farnell; Supplier Part Number 3: 2849971
R800 R801 = gen_R_10k_0603: as R700-R708 on sheet digital_io; Part Number: gen_R_10k_0603; Operating Temperature: -55°C - +155°C; Resistance: 10k; Series: E24, E96; PnP Value: 10k; Supplier 1: Farnell; Supplier Part Number 1: 2073349